# Altium project CPAP_POWER.PrjPcb (part 2 of 2)

## Sheet BLDC.SchDoc
size Letter; ENG_APP_DATE: --/--/--; DSN_APP_DATE: --/--/--; CHK_APP_DATE: --/--/--
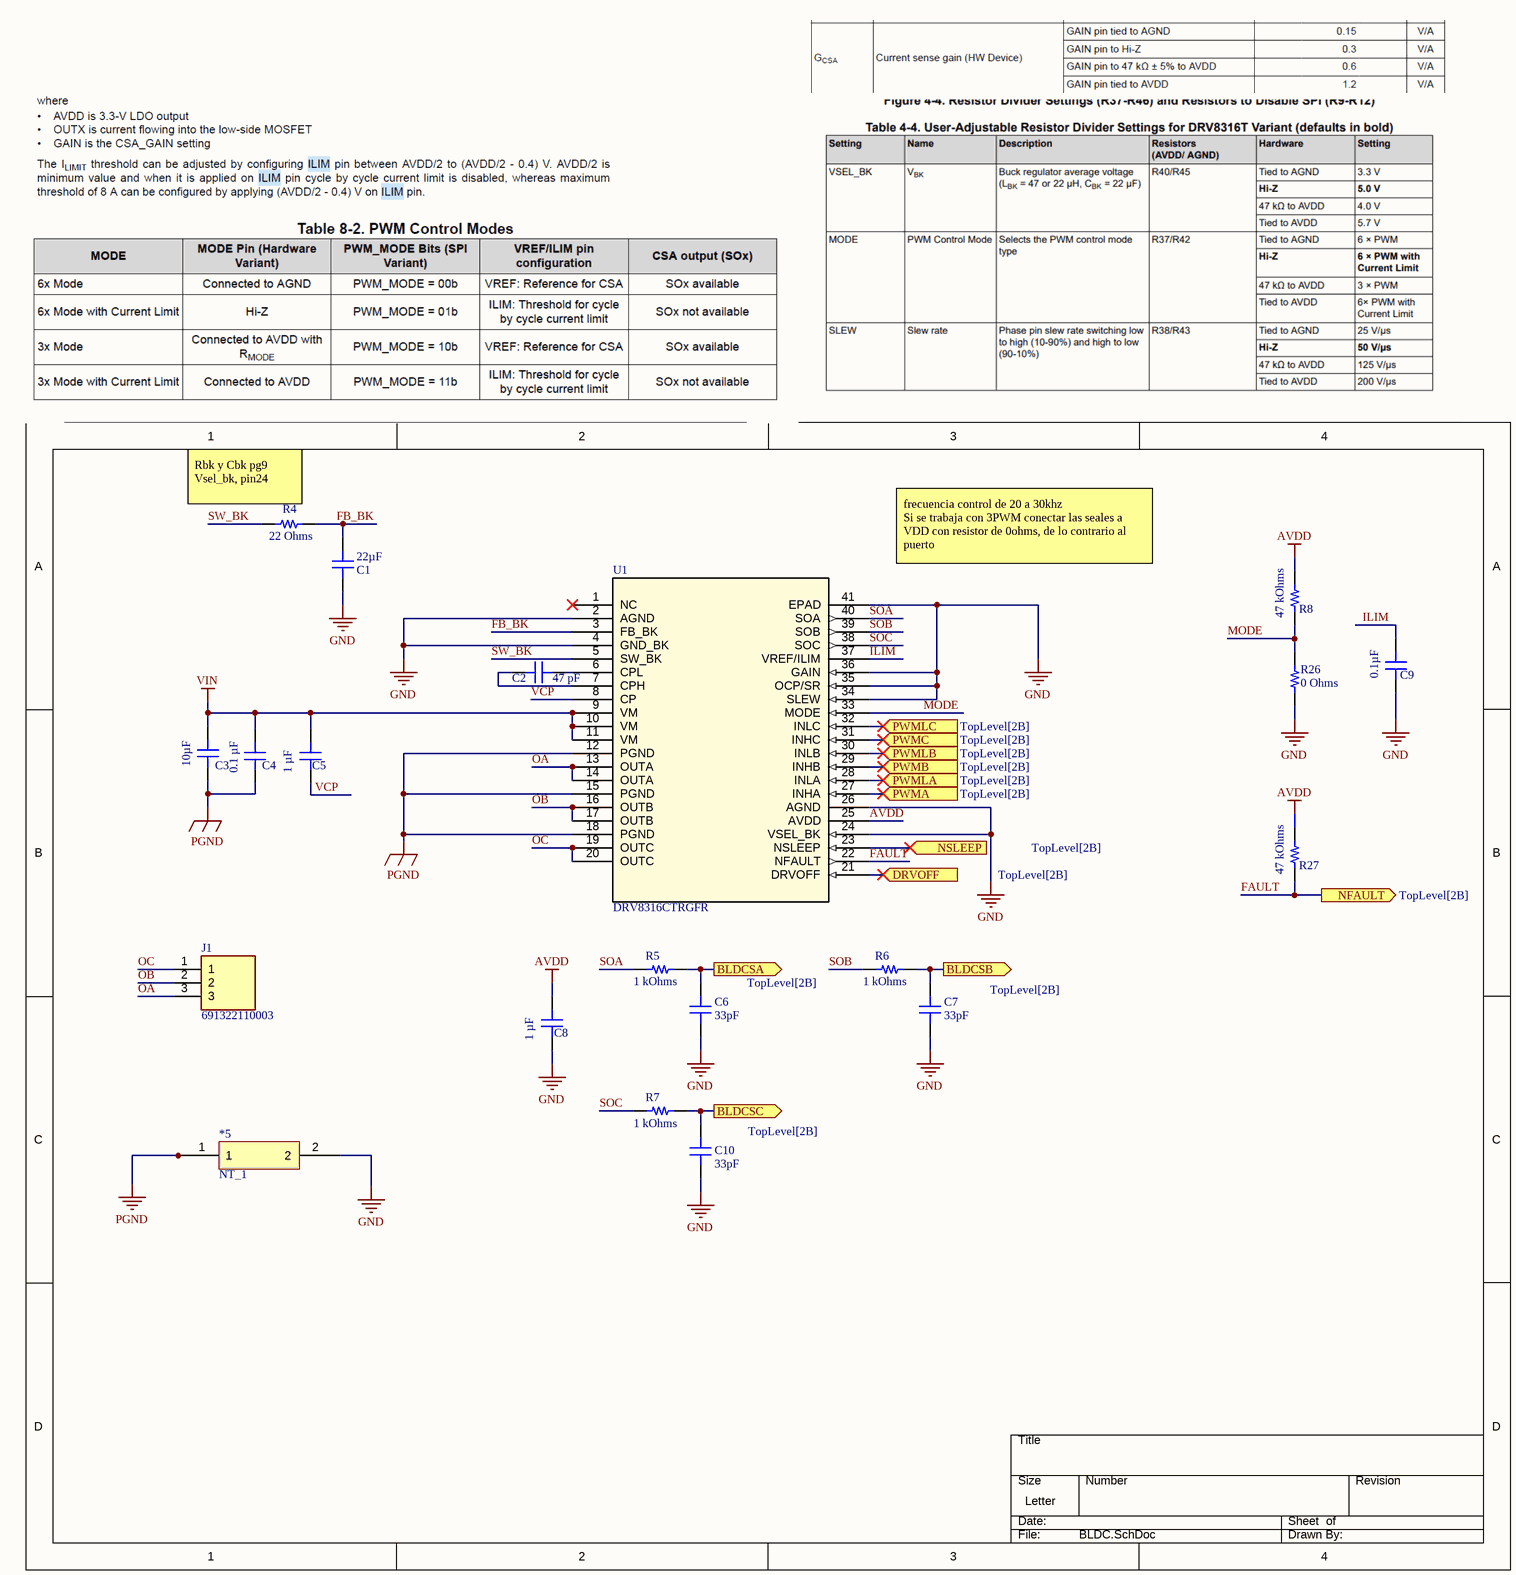
[diagram p7: BLDC.SchDoc]

### Parts
*5  NT_1  [Net_Tie]  (net tie, no BOM)
C1  22µF  [CAP 0805_2012]
C2  47 pF  [CAP 0805_2012]
C3  10µF  [CAP 1210_3225 - 2.8MM]
C4  0.1 µF  [CAP 0603_1608]
C5  Capacitance: 1 µF  [CAP 0805_2012]
C6  33pF  [CAP 0603_1608]
C7  33pF  [CAP 0603_1608]
C8  Capacitance: 1 µF  [CAP 0805_2012]
C9  Capacitance: 0.1µF  [CAP 0805_2012]
C10  33pF  [CAP 0603_1608]
J1  691322110003  [SHDRRA3W80P0X350_1X3_1190X920X700P]
R4  22 Ohms  [YAGEO RES 0603_1608]
R5  1 kOhms  [YAGEO RES 0603_1608]
R6  1 kOhms  [YAGEO RES 0603_1608]
R7  1 kOhms  [YAGEO RES 0603_1608]
R8  47 kOhms  [YAGEO RES 0603_1608]
R26  0 Ohms  [YAGEO RES 0603_1608]
R27  47 kOhms  [YAGEO RES 0603_1608]
U1  DRV8316CTRGFR  [VQFN40_RGF_TEX]

### Ports
BLDCSA (out, see TopLevel[2B]), BLDCSB (out, see TopLevel[2B]), BLDCSC (out, see TopLevel[2B]), DRVOFF (in, see TopLevel[2B]), NFAULT (out, see TopLevel[2B]), NSLEEP (in, see TopLevel[2B]), PWMA (in, see TopLevel[2B]), PWMB (in, see TopLevel[2B]), PWMC (in, see TopLevel[2B]), PWMLA (in, see TopLevel[2B]), PWMLB (in, see TopLevel[2B]), PWMLC (in, see TopLevel[2B])

### Nets
AVDD: C8.1 R8.2 R27.2 U1.25(AVDD)
GND: *5.2 C1.2 C6.1 C7.1 C8.2 C9.2 C10.1 R26.2 U1.2(AGND) U1.4(GND_BK) U1.24(VSEL_BK) U1.26(AGND) U1.34(SLEW) U1.35(OCP/SR) U1.36(GAIN) U1.41(EPAD)
PGND: *5.1 C3.1 C4.2 U1.12(PGND) U1.15(PGND) U1.18(PGND)
VIN: C3.2 C4.1 C5.1 U1.9(VM) U1.10(VM) U1.11(VM)
FAULT: R27.1 U1.22(NFAULT) ; port NFAULT
FB_BK: C1.1 R4.2 U1.3(FB_BK)
ILIM: C9.1 U1.37(VREF/ILIM)
MODE: R8.1 R26.1 U1.33(MODE)
OA: J1.3 U1.13(OUTA) U1.14(OUTA)
OB: J1.2 U1.16(OUTB) U1.17(OUTB)
OC: J1.1 U1.19(OUTC) U1.20(OUTC)
SOA: R5.1 U1.40(SOA)
SOB: R6.1 U1.39(SOB)
SOC: R7.1 U1.38(SOC)
SW_BK: R4.1 U1.5(SW_BK)
VCP: C5.2 U1.8(CP)
NetC2_1: C2.1 U1.7(CPH)
NetC2_2: C2.2 U1.6(CPL)
NetC6_2: C6.2 R5.2 ; port BLDCSA
NetC7_2: C7.2 R6.2 ; port BLDCSB
NetC10_2: C10.2 R7.2 ; port BLDCSC
NetU1_21: U1.21(DRVOFF) ; port DRVOFF
NetU1_23: U1.23(NSLEEP) ; port NSLEEP
NetU1_27: U1.27(INHA) ; port PWMA
NetU1_28: U1.28(INLA) ; port PWMLA
NetU1_29: U1.29(INHB) ; port PWMB
NetU1_30: U1.30(INLB) ; port PWMLB
NetU1_31: U1.31(INHC) ; port PWMC
NetU1_32: U1.32(INLC) ; port PWMLC

Not connected (* = marked no-connect by the designer): U1 1(NC)*

### Notes on the sheet
- (near R4) Rbk y Cbk pg9
  Vsel_bk, pin24
- frecuencia control de 20 a 30khz
  Si se trabaja con 3PWM conectar las seales a VDD con resistor de 0ohms, de lo contrario al puerto
- DWG. NO.
- REV.
- SHT.
- REVISION
- DESCRIPTION
- DATE
- APPROVED
- THIS DOCUMENT AND THE DATA DISCLOSED HEREIN OR HEREWITH IS THE PROPERTY OF ALTIUM LIMITED AND MAY BE FREELY DISTRIBUTED IN WHOLE. NO RIGHTS ARE RESERVED OR EXPRESS OR IMPLIED WARANTEE GIVEN.
- ENG:
- DSN:
- APPROVALS
- PROJECT
- DOCUMENT REVISION:
- DESIGN ITEM:
- CHK:
- BOM:
- REFERENCE DOCUMENTS
- PROJECT REVISION:
- TITLE
- FAB DWG:
- PCB DWG:
- ASSY DWG:
- SCALE:
- SIZE
- C
- CAGE CODE
- FILE NAME
- DWG NO.
- SHEET
- OF
- REV

### Library data of the parts
C1 = 0805ZD226MAT2A: CAP CER 22UF 10V X5R 0805; manufacturer: AVX Corporation; Tolerance: ±20%; value: 22µF; Part Number: 0805ZD226MAT2A; Applications: General Purpose; componentlink1description: Datasheet; componentlink1url: http://datasheets.avx.com/cx5r.pdf; componentlink2description: DigiKey Link; componentlink2url: http://digikey.com/product-detail/en/avx-corporation/0805ZD226MAT2A/478-7966-1-ND/3881589; Device Package: 0805 (2012 Metric); lastupdated: 2020-09-02 01:04:32; Lifecycle Status: Active; Minimum Order: 1; Mounting Type: Surface Mount, MLCC; Operating Temperature: -55°C ~ 85°C; Package / Case: 0805 (2012 Metric); packaging: TapeAndReel; partid: 7750; Part Status: Active; price: 0.10; series: -; Size / Dimension: 0.079" L x 0.049" W (2.00mm x 1.25mm); Supplier 1: DigiKey; Supplier Part Number 1: 478-7966-1-ND; Temperature Coefficient: X5R; Thickness (Max): 0.060" (1.52mm); Voltage - Rated: 10V
C2 = AC0805JRNPO9BN470: CAP CER 47PF 50V C0G/NPO 0805; manufacturer: Yageo; Tolerance: ±5%; Temperature Coefficient: C0G, NP0; value: 47 pF; Part Number: AC0805JRNPO9BN470; Applications: Automotive; componentlink1description: Datasheet; componentlink1url: http://www.yageo.com/NewPortal/_en/search/productDocs.jsp?YageoPartNumber=AC0805JRNPO9BN470; componentlink2description: DigiKey Link; componentlink2url: https://www.digikey.com/en/products/detail/yageo/AC0805JRNPO9BN470/6643124; Device Package: 0805 (2012 Metric); lastupdated: 2024-02-09 20:15:29; Lifecycle Status: Active; Minimum Order: 1; Mounting Type: Surface Mount, MLCC; Operating Temperature: -55°C ~ 125°C; Package / Case: 0805 (2012 Metric); packaging: TapeAndReel; partid: 16022; Part Status: Active; price: 0.02; Ratings: AEC-Q200; series: AC; Size / Dimension: 0.079" L x 0.049" W (2.00mm x 1.25mm); Supplier 1: DigiKey; Supplier Part Number 1: 311-3138-1-ND; Thickness (Max): 0.028" (0.70mm); Voltage - Rated: 50V
C3 = 1210DD106KAT2A: CAP CER 10UF 35V X5R 1210; manufacturer: AVX Corporation; Tolerance: ±10%; Value: 10µF; componentlink2description: DigiKey Link; componentlink2url: http://digikey.com/product-detail/en/avx-corporation/1210DD106KAT2A/478-12271-1-ND/9565678; Temperature Coefficient: X5R; Capacitance: 10µF; Part Number: 1210DD106KAT2A; Applications: General Purpose; componentlink1description: Datasheet; componentlink1url: http://datasheets.avx.com/cx5r.pdf; Device Package: 1210 (3225 Metric); lastupdated: 2020-09-02 01:10:50; Lifecycle Status: Active; Minimum Order: 1; Mounting Type: Surface Mount, MLCC; Operating Temperature: -55°C ~ 85°C; Package / Case: 1210 (3225 Metric); packaging: TapeAndReel; partid: 23974; Part Status: Active; price: 0.66; series: -; Size / Dimension: 0.126" L x 0.098" W (3.20mm x 2.50mm); Supplier 1: DigiKey; Supplier Part Number 1: 478-12271-1-ND; Thickness (Max): 0.110" (2.79mm); Voltage - Rated: 35V
C4 = GMJ107BB7104KAHT: CAP CER 0.1UF 35V X7R 0603; manufacturer: Taiyo Yuden; Tolerance: ±10%; value: 0.1 µF; Part Number: GMJ107BB7104KAHT; Applications: Automotive, Boardflex Sensitive; componentlink1description: Datasheet; componentlink1url: https://ds.yuden.co.jp/TYCOMPAS/ut/detail?pn=GMJ107BB7104KAHT &u=M; componentlink2description: DigiKey Link; componentlink2url: https://www.digikey.com/en/products/detail/taiyo-yuden/GMJ107BB7104KAHT/5880015; Device Package: 0603 (1608 Metric); Features: Soft Termination; lastupdated: 2024-02-09 20:10:10; Lifecycle Status: Active; Minimum Order: 1; Mounting Type: Surface Mount, MLCC; Operating Temperature: -55°C ~ 125°C; Package / Case: 0603 (1608 Metric); packaging: TapeAndReel; partid: 16165; Part Status: Active; price: 0.04; Ratings: AEC-Q200; series: M; Size / Dimension: 0.063" L x 0.031" W (1.60mm x 0.80mm); Supplier 1: DigiKey; Supplier Part Number 1: 587-4467-1-ND; Temperature Coefficient: X7R; Thickness (Max): 0.039" (1.00mm); Voltage - Rated: 35V
C5 C8 = CC0805MKY5V9BB105: CAP CER 1UF 50V Y5V 0805; manufacturer: Yageo; Tolerance: ±20%; Temperature Coefficient: Y5V (F); Part Number: CC0805MKY5V9BB105; Applications: General Purpose; componentlink1description: Datasheet; componentlink1url: http://www.yageo.com/documents/recent/UPY-GPHC_Y5V_6.3V-to-50V_8.pdf; componentlink2description: DigiKey Link; componentlink2url: https://www.digikey.com/en/products/detail/yageo/CC0805MKY5V9BB105/5884272; Device Package: 0805 (2012 Metric); lastupdated: 2024-02-09 20:15:56; Lifecycle Status: Active; Minimum Order: 1; Mounting Type: Surface Mount, MLCC; Operating Temperature: -30°C ~ 85°C; Package / Case: 0805 (2012 Metric); packaging: TapeAndReel; partid: 7367; Part Status: Active; price: 0.03; series: CC; Size / Dimension: 0.079" L x 0.049" W (2.00mm x 1.25mm); Supplier 1: DigiKey; Supplier Part Number 1: 311-3435-1-ND; Thickness (Max): 0.057" (1.45mm); Voltage - Rated: 50V
C6 C7 C10 = 0603YC330JAT2A: CAP CER 33PF 16V X7R 0603; manufacturer: AVX Corporation; Tolerance: ±5%; value: 33pF; Part Number: 0603YC330JAT2A; Applications: General Purpose; componentlink1description: Datasheet; componentlink1url: http://datasheets.avx.com/X7RDielectric.pdf; componentlink2description: DigiKey Link; componentlink2url: http://digikey.com/product-detail/en/avx-corporation/0603YC330JAT2A/478-6211-1-ND/2391410; Device Package: 0603 (1608 Metric); lastupdated: 2020-09-02 01:03:19; Lifecycle Status: Active; Minimum Order: 1; Mounting Type: Surface Mount, MLCC; Operating Temperature: -55°C ~ 125°C; Package / Case: 0603 (1608 Metric); packaging: TapeAndReel; partid: 11539; Part Status: Active; price: 0.03; series: -; Size / Dimension: 0.063" L x 0.032" W (1.60mm x 0.81mm); Supplier 1: DigiKey; Supplier Part Number 1: 478-6211-1-ND; Temperature Coefficient: X7R; Thickness (Max): 0.035" (0.90mm); Voltage - Rated: 16V
C9 = 08053E104ZAT2A: CAP CER 0.1UF 25V Z5U 0805; manufacturer: AVX Corporation; Tolerance: -20%, +80%; Part Number: 08053E104ZAT2A; Applications: General Purpose; componentlink2description: DigiKey Link; componentlink2url: http://digikey.com/product-detail/en/avx-corporation/08053E104ZAT2A/478-12769-1-ND/9949310; Device Package: 0805 (2012 Metric); lastupdated: 2020-09-02 01:04:40; Lifecycle Status: Active; Minimum Order: 1; Mounting Type: Surface Mount, MLCC; Operating Temperature: 10°C ~ 85°C; Package / Case: 0805 (2012 Metric); packaging: TapeAndReel; partid: 3602; Part Status: Active; price: 0.04; series: -; Size / Dimension: 0.079" L x 0.049" W (2.00mm x 1.25mm); Supplier 1: DigiKey; Supplier Part Number 1: 478-12769-1-ND; Temperature Coefficient: Z5U; Thickness (Max): 0.037" (0.94mm); Voltage - Rated: 25V
J1 = 691322110003: Pluggable Terminal Block Wurth Elektronik 3221 Series 3.5mm Pitch, 3 Way Straight, PCB Header, Through Hole; Geometry.Height: 7mm; Manufacturer_Name: Wurth Elektronik; Manufacturer_Part_Number: 691322110003; Mouser Part Number: 710-691322110003; Mouser Price/Stock: https://www.mouser.co.uk/ProductDetail/Wurth-Elektronik/691322110003?qs=E2PpAYvlWVuH5qLC1GE%2FCQ%3D%3D; Arrow Part Number: *; Arrow Price/Stock: *; Datasheet Link: http://katalog.we-online.de/em/datasheet/6913221100xx.pdf
R4 = AC0603FR-0722RL: RES SMD 22 OHM 1% 1/10W 0603; Manufacturer: Yageo; Power (Watts): 0.1W, 1/10W; Temperature Coefficient: ±100ppm/°C; Tolerance: ±1%; Value: 22 Ohms; Part Number: AC0603FR-0722RL; ComponentLink1Description: Datasheet; ComponentLink1URL: https://www.yageo.com/upload/media/product/productsearch/datasheet/rchip/PYu-AC_51_RoHS_L_7.pdf; ComponentLink2Description: DigiKey Link; ComponentLink2URL: https://www.digikey.com/en/products/detail/yageo/AC0603FR-0722RL/5895927; Composition: Thick Film; Device Package: 0603 (1608 Metric); Features: Automotive AEC-Q200, Moisture Resistant; Height - Seated (Max): 0.022" (0.55mm); LastUpdated: 2024-07-25 09:19:25; Lifecycle Status: Active; Minimum Order: 1; Number of Terminations: 2; Operating Temperature: -55°C ~ 155°C; Package / Case: 0603 (1608 Metric); Packaging: CutTape; PartId: 16487; Part Status: Active; Price: 0.01; Ratings: AEC-Q200; Resistance: 22 Ohms; Series: AC; Size / Dimension: 0.063" L x 0.031" W (1.60mm x 0.80mm); Supplier 1: DigiKey; Supplier Part Number 1: YAG3581CT-ND; Supplier Device Package: 0603
R5-R7 = AT0603DRD071KL: RES SMD 1K OHM 0.5% 1/10W 0603; Manufacturer: Yageo; Power (Watts): 0.1W, 1/10W; Temperature Coefficient: ±25ppm/°C; Part Number: AT0603DRD071KL; Value: 1 kOhms; ComponentLink1Description: Datasheet; ComponentLink1URL: http://www.yageo.com/documents/recent/PYu-AT_51_RoHS_L_5.pdf; ComponentLink2Description: DigiKey Link; ComponentLink2URL: https://www.digikey.com/en/products/detail/yageo/AT0603DRD071KL/5138634; Composition: Thin Film; Device Package: 0603 (1608 Metric); Features: Anti-Sulfur, Automotive AEC-Q200, Moisture Resistant; Height - Seated (Max): 0.022" (0.55mm); LastUpdated: 2024-07-25 09:19:32; Lifecycle Status: Active; Minimum Order: 1; Number of Terminations: 2; Operating Temperature: -55°C ~ 155°C; Package / Case: 0603 (1608 Metric); Packaging: TapeAndReel; PartId: 4899; Part Status: Active; Price: 0.02; Ratings: AEC-Q200; Resistance: 1 kOhms; Series: AT; Size / Dimension: 0.063" L x 0.031" W (1.60mm x 0.80mm); Supplier 1: DigiKey; Supplier Part Number 1: YAG2115CT-ND; Supplier Device Package: 0603; Tolerance: ±0.5%
R8 R27 = RT0603FRE0747KL: RES SMD 47K OHM 1% 1/10W 0603; Manufacturer: Yageo; Power (Watts): 0.1W, 1/10W; Temperature Coefficient: ±50ppm/°C; Tolerance: ±1%; Value: 47 kOhms; Part Number: RT0603FRE0747KL; ComponentLink1Description: Datasheet; ComponentLink1URL: https://www.yageo.com/upload/media/product/productsearch/datasheet/rchip/PYu-RT_1-to-0.01_RoHS_L_11.pdf; ComponentLink2Description: DigiKey Link; ComponentLink2URL: https://www.digikey.com/en/products/detail/yageo/RT0603FRE0747KL/1075386; Composition: Thin Film; Device Package: 0603 (1608 Metric); Height - Seated (Max): 0.022" (0.55mm); LastUpdated: 2024-07-25 09:19:32; Lifecycle Status: Active; Minimum Order: 1; Number of Terminations: 2; Operating Temperature: -55°C ~ 155°C; Package / Case: 0603 (1608 Metric); Packaging: TapeAndReel; PartId: 5674; Part Status: Active; Price: 0.01; Resistance: 47 kOhms; Series: RT; Size / Dimension: 0.063" L x 0.031" W (1.60mm x 0.80mm); Supplier 1: DigiKey; Supplier Part Number 1: YAG3355CT-ND; Supplier Device Package: 0603
R26 = RC0603FR-100RL: RES 0 OHM JUMPER 1/10W 0603; Manufacturer: Yageo; Part Number: RC0603FR-100RL; Value: 0 Ohms; ComponentLink1Description: Datasheet; ComponentLink1URL: https://www.yageo.com/upload/media/product/productsearch/datasheet/rchip/PYu-RC_Group_51_RoHS_L_12.pdf; ComponentLink2Description: DigiKey Link; ComponentLink2URL: https://www.digikey.com/en/products/detail/yageo/RC0603FR-100RL/1303802; Composition: Thick Film; Device Package: 0603 (1608 Metric); Features: Moisture Resistant; Height - Seated (Max): 0.022" (0.55mm); LastUpdated: 2024-07-25 09:19:04; Lifecycle Status: Active; Minimum Order: 1; Number of Terminations: 2; Operating Temperature: -55°C ~ 155°C; Package / Case: 0603 (1608 Metric); Packaging: CutTape; PartId: 77830; Part Status: Active; Price: 0.01; Resistance: 0 Ohms; Series: RC_L; Size / Dimension: 0.063" L x 0.031" W (1.60mm x 0.80mm); Supplier 1: DigiKey; Supplier Part Number 1: 13-RC0603FR-100RLCT-ND; Supplier Device Package: 0603; Tolerance: Jumper
U1 = DRV8316CTRGFR: No Description Available; Mfr_Name: Texas Instruments; Type: DEV; Copyright: Copyright (C) 2024 Ultra Librarian. All rights reserved.; Manufacturer_Part_Number: DRV8316CTRGFR; RefDes: RefDes

## Sheet MCU.SchDoc
size Letter
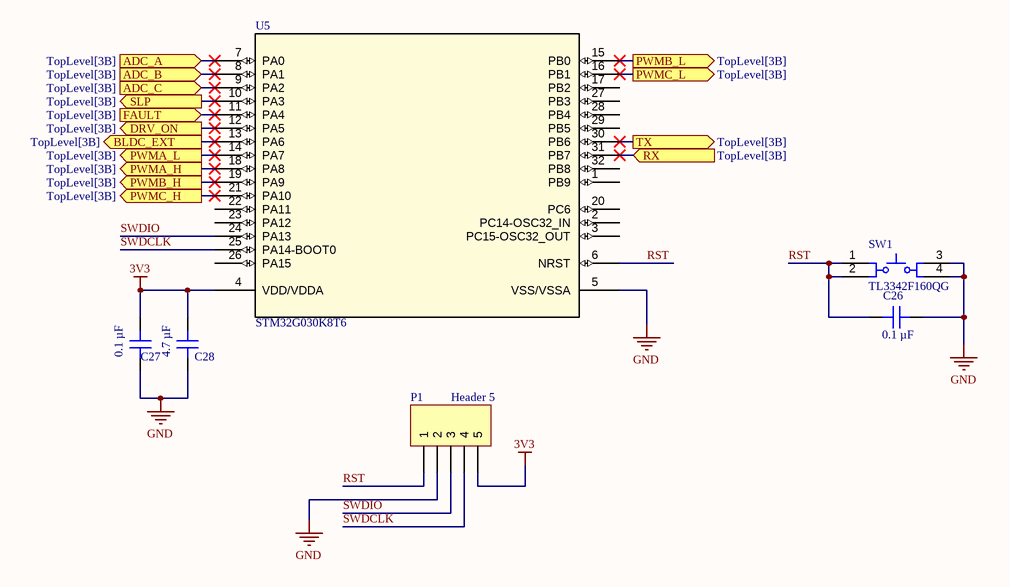
[diagram p8: MCU.SchDoc]

### Parts
C26  0.1 µF  [CAP 0805_2012]
C27  0.1 µF  [CAP 0805_2012]
C28  4.7 µF  [CAP 0805_2012]
P1  Header 5  [HDR1X5]
SW1  TL3342F160QG  [ESWI-TL3342F160QG_V]
U5  STM32G030K8T6  [LQFP-32]

### Ports
ADC_A (in, see TopLevel[3B]), ADC_B (in, see TopLevel[3B]), ADC_C (in, see TopLevel[3B]), BLDC_EXT (out, see TopLevel[3B]), DRV_ON (out, see TopLevel[3B]), FAULT (in, see TopLevel[3B]), PWMA_H (out, see TopLevel[3B]), PWMA_L (out, see TopLevel[3B]), PWMB_H (out, see TopLevel[3B]), PWMB_L (out, see TopLevel[3B]), PWMC_H (out, see TopLevel[3B]), PWMC_L (out, see TopLevel[3B]), RX (in, see TopLevel[3B]), SLP (out, see TopLevel[3B]), TX (out, see TopLevel[3B])

### Nets
3V3: C27.2 C28.2 P1.5 U5.4(VDD/VDDA)
GND: C26.1 C27.1 C28.1 P1.2 SW1.3 SW1.4 U5.5(VSS/VSSA)
BLDC_E: U5.13(PA6) ; port BLDC_EXT
FAULT: U5.11(PA4) ; port FAULT
RST: C26.2 P1.1 SW1.1 SW1.2 U5.6(NRST)
RX: U5.31(PB7) ; port RX
SWDCLK: P1.4 U5.25(PA14-BOOT0)
SWDIO: P1.3 U5.24(PA13)
TX: U5.30(PB6) ; port TX
NetC6_2: U5.7(PA0) ; port ADC_A
NetC7_2: U5.8(PA1) ; port ADC_B
NetC10_2: U5.9(PA2) ; port ADC_C
NetU1_21: U5.12(PA5) ; port DRV_ON
NetU1_23: U5.10(PA3) ; port SLP
NetU1_27: U5.18(PA8) ; port PWMA_H
NetU1_28: U5.14(PA7) ; port PWMA_L
NetU1_29: U5.19(PA9) ; port PWMB_H
NetU1_30: U5.15(PB0) ; port PWMB_L
NetU1_31: U5.21(PA10) ; port PWMC_H
NetU1_32: U5.16(PB1) ; port PWMC_L

Not connected (* = marked no-connect by the designer): U5 1(PB9) 2(PC14-OSC32_IN) 3(PC15-OSC32_OUT) 17(PB2) 20(PC6) 22(PA11) 23(PA12) 26(PA15) 27(PB3) 28(PB4) 29(PB5) 32(PB8)

### Notes on the sheet
- DWG. NO.
- REV.
- SHT.
- REVISION
- DESCRIPTION
- DATE
- APPROVED
- THIS DOCUMENT AND THE DATA DISCLOSED HEREIN OR HEREWITH IS THE PROPERTY OF ALTIUM LIMITED AND MAY BE FREELY DISTRIBUTED IN WHOLE. NO RIGHTS ARE RESERVED OR EXPRESS OR IMPLIED WARANTEE GIVEN.
- ENG:
- DSN:
- APPROVALS
- PROJECT
- DOCUMENT REVISION:
- DESIGN ITEM:
- CHK:
- BOM:
- REFERENCE DOCUMENTS
- PROJECT REVISION:
- TITLE
- FAB DWG:
- PCB DWG:
- ASSY DWG:
- SCALE:
- SIZE
- C
- CAGE CODE
- FILE NAME
- DWG NO.
- SHEET
- OF
- REV

### Library data of the parts
C26 C27 = CC0805KRX7R7BB104: CAP CER 0.1UF 16V X7R 0805; manufacturer: Yageo; Tolerance: ±10%; Part Number: CC0805KRX7R7BB104; Capacitance: 0.1 µF; Applications: General Purpose; componentlink1description: Datasheet; componentlink1url: https://www.yageo.com/upload/media/product/productsearch/datasheet/mlcc/UPY-GPHC_X7R_6.3V-to-50V_18.pdf; componentlink2description: DigiKey Link; componentlink2url: https://www.digikey.com/en/products/detail/yageo/CC0805KRX7R7BB104/302876; Device Package: 0805 (2012 Metric); Features: High Voltage; lastupdated: 2024-02-09 20:15:42; Lifecycle Status: Active; Minimum Order: 1; Mounting Type: Surface Mount, MLCC; Operating Temperature: -55°C ~ 125°C; Package / Case: 0805 (2012 Metric); packaging: TapeAndReel; partid: 12765; Part Status: Active; price: 0.01; series: CC; Size / Dimension: 0.079" L x 0.049" W (2.00mm x 1.25mm); Supplier 1: DigiKey; Supplier Part Number 1: 311-1142-1-ND; Temperature Coefficient: X7R; Thickness (Max): 0.033" (0.85mm); value: 0.1 µF; Voltage - Rated: 16V
C28 = CC0805KRX5R6BB475: CAP CER 4.7UF 10V X5R 0805; manufacturer: Yageo; Tolerance: ±10%; Part Number: CC0805KRX5R6BB475; Capacitance: 4.7 µF; Applications: General Purpose; componentlink1description: Datasheet; componentlink1url: https://www.yageo.com/upload/media/product/productsearch/datasheet/mlcc/UPY-GPHC_X5R_4V-to-50V_25.pdf; componentlink2description: DigiKey Link; componentlink2url: https://www.digikey.com/en/products/detail/yageo/CC0805KRX5R6BB475/5884183; Device Package: 0805 (2012 Metric); lastupdated: 2024-02-09 20:15:46; Lifecycle Status: Active; Minimum Order: 1; Mounting Type: Surface Mount, MLCC; Operating Temperature: -55°C ~ 85°C; Package / Case: 0805 (2012 Metric); packaging: TapeAndReel; partid: 11449; Part Status: Active; price: 0.07; series: CC; Size / Dimension: 0.079" L x 0.049" W (2.00mm x 1.25mm); Supplier 1: DigiKey; Supplier Part Number 1: 311-3426-1-ND; Temperature Coefficient: X5R; Thickness (Max): 0.057" (1.45mm); value: 4.7 µF; Voltage - Rated: 10V
P1 = Header 5: Header, 5-Pin; LatestRevisionDate: 17-Jul-2002; LatestRevisionNote: Re-released for DXP Platform.; Publisher: Altium Limited
SW1 = TL3342F160QG: Switch, Tactile, SPST-NO, 50 mA, 12 V, 4-Pin SMD, RoHS, Tape and Reel; Tolerance: 20%; Voltage Rating (DC): 50 V; Case\Package: Radial; Capacitance: 4.7 uF; RoHSCompliant: true; Min Operating Temperature: -40 degC; Width: 0 inch; Max Operating Temperature: 85 degC; ComponentLink1Description: Manufacturer URL; ComponentLink2Description: Datasheet; DatasheetVersion: Rev. I, 12/2010; ComponentLink1URL: http://www.e-switch.ch/en/; ComponentLink2URL: http://spec_sheets.e-switch.com/specs/P010632.pdf; PackageReference: TL3342F160QG; Pins: 2; Voltage Rating: 50 V; Mount: Through Hole; Length: 11 mm; REACH SVHC: No SVHC; Radiation Hardening: No; Lead Pitch: 2 mm; Diameter: 5 mm; Package Quantity: 200; Height: 11 mm; Packaging: Bulk; PackageDescription: 4-Pin Surface Mount Device, Body 5 x 5 mm, Pitch 6.3 mm; PartNumber: TL3342F160QG
U5 = STM32G030K8T6: No Description Available; Mfr_Name: STMicroelectronics; RefDes: RefDes; Type: Type

## Sheet Sensors.SchDoc
size Letter
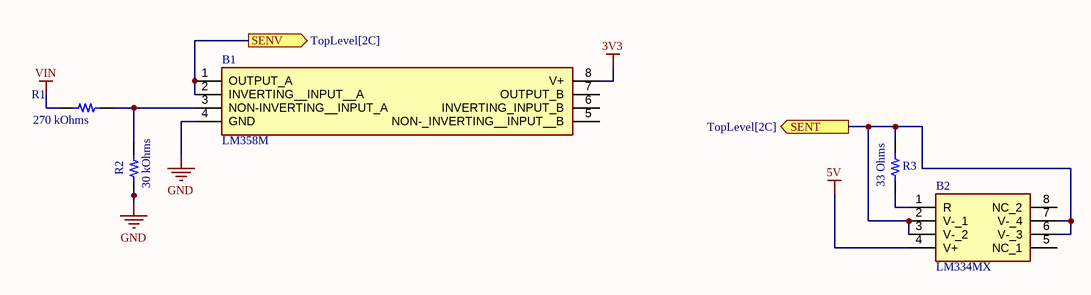
[diagram p9: Sensors.SchDoc]

### Parts
B1  LM358M  [SOIC127P600X175-8N]
B2  LM334MX  [SOIC127P600X175-8N]
R1  270 kOhms  [YAGEO RES 0603_1608]
R2  30 kOhms  [YAGEO RES 0603_1608]
R3  33 Ohms  [YAGEO RES 0603_1608]

### Ports
SENT (out, see TopLevel[2C]), SENV (out, see TopLevel[2C])

### Nets
3V3: B1.8(V+)
5V: B2.4(V+)
GND: B1.4(GND) R2.1
VIN: R1.2
SENT: B2.2(V-_1) B2.3(V-_2) B2.6(V-_3) B2.7(V-_4) R3.1 ; port SENT
SENV: B1.1(OUTPUT_A) B1.2(INVERTING__INPUT__A) ; port SENV
NetB1_3: B1.3(NON-INVERTING__INPUT_A) R1.1 R2.2
NetB2_1: B2.1(R) R3.2

Not connected (* = marked no-connect by the designer): B1 5(NON-_INVERTING__INPUT__B) 6(INVERTING_INPUT_B) 7(OUTPUT_B); B2 5(NC_1) 8(NC_2)

### Notes on the sheet
- DWG. NO.
- REV.
- SHT.
- REVISION
- DESCRIPTION
- DATE
- APPROVED
- THIS DOCUMENT AND THE DATA DISCLOSED HEREIN OR HEREWITH IS THE PROPERTY OF ALTIUM LIMITED AND MAY BE FREELY DISTRIBUTED IN WHOLE. NO RIGHTS ARE RESERVED OR EXPRESS OR IMPLIED WARANTEE GIVEN.
- ENG:
- DSN:
- APPROVALS
- PROJECT
- DOCUMENT REVISION:
- DESIGN ITEM:
- CHK:
- BOM:
- REFERENCE DOCUMENTS
- PROJECT REVISION:
- TITLE
- FAB DWG:
- PCB DWG:
- ASSY DWG:
- SCALE:
- SIZE
- C
- CAGE CODE
- FILE NAME
- DWG NO.
- SHEET
- OF
- REV

### Library data of the parts
B1 = LM358M: Low Power Dual Operational Amplifiers; Manufacturer_Name: Texas Instruments; Geometry.Height: 1.75mm; Manufacturer_Part_Number: LM358M; Mouser Part Number: 926-LM358M; Mouser Price/Stock: https://www.mouser.co.uk/ProductDetail/Texas-Instruments/LM358M?qs=QbsRYf82W3HovI3qmwfgKw%3D%3D; Arrow Part Number: LM358M; Arrow Price/Stock: https://www.arrow.com/en/products/lm358m/texas-instruments?region=nac; Datasheet Link: http://www.ti.com/general/docs/suppproductinfo.tsp?distId=10&gotoUrl=http%3A%2F%2Fwww.ti.com%2Flit%2Fgpn%2Flm158-n
B2 = LM334MX: Current & Power Monitors & Regulators 3-Terminal Adjustable Current Source 8-SOIC 0 to 70; Manufacturer_Name: Texas Instruments; Geometry.Height: 1.75mm; Manufacturer_Part_Number: LM334MX; Mouser Part Number: 926-LM334MX; Mouser Price/Stock: https://www.mouser.co.uk/ProductDetail/Texas-Instruments/LM334MX?qs=X1J7HmVL2ZFtDDpPn2fvWQ%3D%3D; Arrow Part Number: *; Arrow Price/Stock: *; Datasheet Link: https://www.ti.com/lit/ds/symlink/lm334.pdf?ts=1637153972899&ref_url=https%253A%252F%252Fwww.ti.com%252Fstore%252Fti%252Fen%252Fp%252Fproduct%252F%253Fp%253DLM334MX%252FNOPB
R1 = RC0603FR-07270KL: RES 270K OHM 1% 1/10W 0603; Manufacturer: Yageo; Power (Watts): 0.1W, 1/10W; Temperature Coefficient: ±100ppm/°C; Tolerance: ±1%; Value: 270 kOhms; Part Number: RC0603FR-07270KL; ComponentLink1Description: Datasheet; ComponentLink1URL: https://www.yageo.com/upload/media/product/productsearch/datasheet/rchip/PYu-RC_Group_51_RoHS_L_10.pdf; ComponentLink2Description: DigiKey Link; ComponentLink2URL: https://www.digikey.com/en/products/detail/yageo/RC0603FR-07270KL/727104; Composition: Thick Film; Device Package: 0603 (1608 Metric); Features: Moisture Resistant; Height - Seated (Max): 0.022" (0.55mm); LastUpdated: 2024-07-25 09:19:27; Lifecycle Status: Active; Minimum Order: 1; Number of Terminations: 2; Operating Temperature: -55°C ~ 155°C; Package / Case: 0603 (1608 Metric); Packaging: CutTape; PartId: 12358; Part Status: Active; Price: 0.01; Resistance: 270 kOhms; Series: RC_L; Size / Dimension: 0.063" L x 0.031" W (1.60mm x 0.80mm); Supplier 1: DigiKey; Supplier Part Number 1: 311-270KHRCT-ND; Supplier Device Package: 0603
R2 = AC0603FR-0730KL: RES SMD 30K OHM 1% 1/10W 0603; Manufacturer: Yageo; Power (Watts): 0.1W, 1/10W; Temperature Coefficient: ±100ppm/°C; Tolerance: ±1%; Value: 30 kOhms; Part Number: AC0603FR-0730KL; ComponentLink1Description: Datasheet; ComponentLink1URL: https://www.yageo.com/upload/media/product/productsearch/datasheet/rchip/PYu-AC_51_RoHS_L_7.pdf; ComponentLink2Description: DigiKey Link; ComponentLink2URL: https://www.digikey.com/en/products/detail/yageo/AC0603FR-0730KL/5896025; Composition: Thick Film; Device Package: 0603 (1608 Metric); Features: Automotive AEC-Q200, Moisture Resistant; Height - Seated (Max): 0.022" (0.55mm); LastUpdated: 2024-07-25 09:19:23; Lifecycle Status: Active; Minimum Order: 1; Number of Terminations: 2; Operating Temperature: -55°C ~ 155°C; Package / Case: 0603 (1608 Metric); Packaging: CutTape; PartId: 17451; Part Status: Active; Price: 0.01; Ratings: AEC-Q200; Resistance: 30 kOhms; Series: AC; Size / Dimension: 0.063" L x 0.031" W (1.60mm x 0.80mm); Supplier 1: DigiKey; Supplier Part Number 1: YAG3593CT-ND; Supplier Device Package: 0603
R3 = RC0603JR-0733RL: RES 33 OHM 5% 1/10W 0603; Manufacturer: Yageo; Power (Watts): 0.1W, 1/10W; Temperature Coefficient: ±100ppm/°C; Tolerance: ±5%; Value: 33 Ohms; Part Number: RC0603JR-0733RL; ComponentLink1Description: Datasheet; ComponentLink1URL: https://www.yageo.com/upload/media/product/productsearch/datasheet/rchip/PYu-RC_Group_51_RoHS_L_10.pdf; ComponentLink2Description: DigiKey Link; ComponentLink2URL: https://www.digikey.com/en/products/detail/yageo/RC0603JR-0733RL/726771; Composition: Thick Film; Device Package: 0603 (1608 Metric); Features: Moisture Resistant; Height - Seated (Max): 0.022" (0.55mm); LastUpdated: 2024-07-25 09:19:24; Lifecycle Status: Active; Minimum Order: 1; Number of Terminations: 2; Operating Temperature: -55°C ~ 155°C; Package / Case: 0603 (1608 Metric); Packaging: CutTape; PartId: 17082; Part Status: Active; Price: 0.01; Resistance: 33 Ohms; Series: RC_L; Size / Dimension: 0.063" L x 0.031" W (1.60mm x 0.80mm); Supplier 1: DigiKey; Supplier Part Number 1: 311-33GRCT-ND; Supplier Device Package: 0603

## Nets that join several sheets
3V: TopLevel (J2.3), Supply_3V0 (C13.1 R9.2 R10.2 U2.4)
3V3: TopLevel (J2.1 J2.2), Supply_3V3 (C16.1 R12.2 U6.4), MCU (C27.2 C28.2 P1.5 U5.4), Sensors (B1.8)
5V: TopLevel (J2.4), Supply_5V0 (C19.1 R13.2 U3.4), Supply_3V3 (C14.1 C15.1 U6.3), Supply_3V0 (C11.1 C12.1 U2.3), BLDC_ext (IC1.2 P2.2 R20.2), Sensors (B2.4)
12V: Supply_5V0 (C17.1 C18.1 U3.3), Supply_12V (C20.1 L1.2 R14.2 U4.4)
GND: TopLevel (J2.5 J2.6 J4.3 J5.2), Supply_5V0 (5 pins), Supply_12V (9 pins), Supply_3V3 (5 pins), Supply_3V0 (5 pins), U_PowerOut 1 (C25_2.2 D6_2.2 Q2_2.2 R19_2.2), BLDC_ext (C29.1 IC2.2 J6.2 P2.1), BLDC (16 pins), U_PowerOut 1 (C25_1.2 D6_1.2 Q2_1.2 R19_1.2), MCU (7 pins), Sensors (B1.4 R2.1)
VIN: TopLevel (J4.4), Supply_12V (C21.1 C22.1 C23.1 U4.1), U_PowerOut 1 (C25_2.1 Q1_2.3 R15_2.1), BLDC_ext (J6.1), BLDC (6 pins), U_PowerOut 1 (C25_1.1 Q1_1.3 R15_1.1), Sensors (R1.2)
BLDC_E: BLDC_ext (R23.1 R24.1), MCU (U5.13)
FAULT: BLDC (R27.1 U1.22), MCU (U5.11)
HUM: TopLevel (J4.1), U_PowerOut 1 (Q1_2.2 R17_2.1)
NetC6_2: BLDC (C6.2 R5.2), MCU (U5.7)
NetC7_2: BLDC (C7.2 R6.2), MCU (U5.8)
NetC10_2: BLDC (C10.2 R7.2), MCU (U5.9)
NetJ5_1: TopLevel (J5.1), U_PowerOut 1 (Q1_1.2 R17_1.1)
NetU1_21: BLDC (U1.21), MCU (U5.12)
NetU1_23: BLDC (U1.23), MCU (U5.10)
NetU1_27: BLDC (U1.27), MCU (U5.18)
NetU1_28: BLDC (U1.28), MCU (U5.14)
NetU1_29: BLDC (U1.29), MCU (U5.19)
NetU1_30: BLDC (U1.30), MCU (U5.15)
NetU1_31: BLDC (U1.31), MCU (U5.21)
NetU1_32: BLDC (U1.32), MCU (U5.16)
PW_F: TopLevel (J3.4), U_PowerOut 1 (R18_1.1 R19_1.1)
PW_H: TopLevel (J3.3), U_PowerOut 1 (R18_2.1 R19_2.1)
RX: TopLevel (J3.5), MCU (U5.31)
SENT: TopLevel (J3.1 J4.2), Sensors (5 pins)
SENV: TopLevel (J3.2), Sensors (B1.1 B1.2)
TX: TopLevel (J3.6), MCU (U5.30)